# EAGLE design a8_dev (EAGLE 6.5.0)
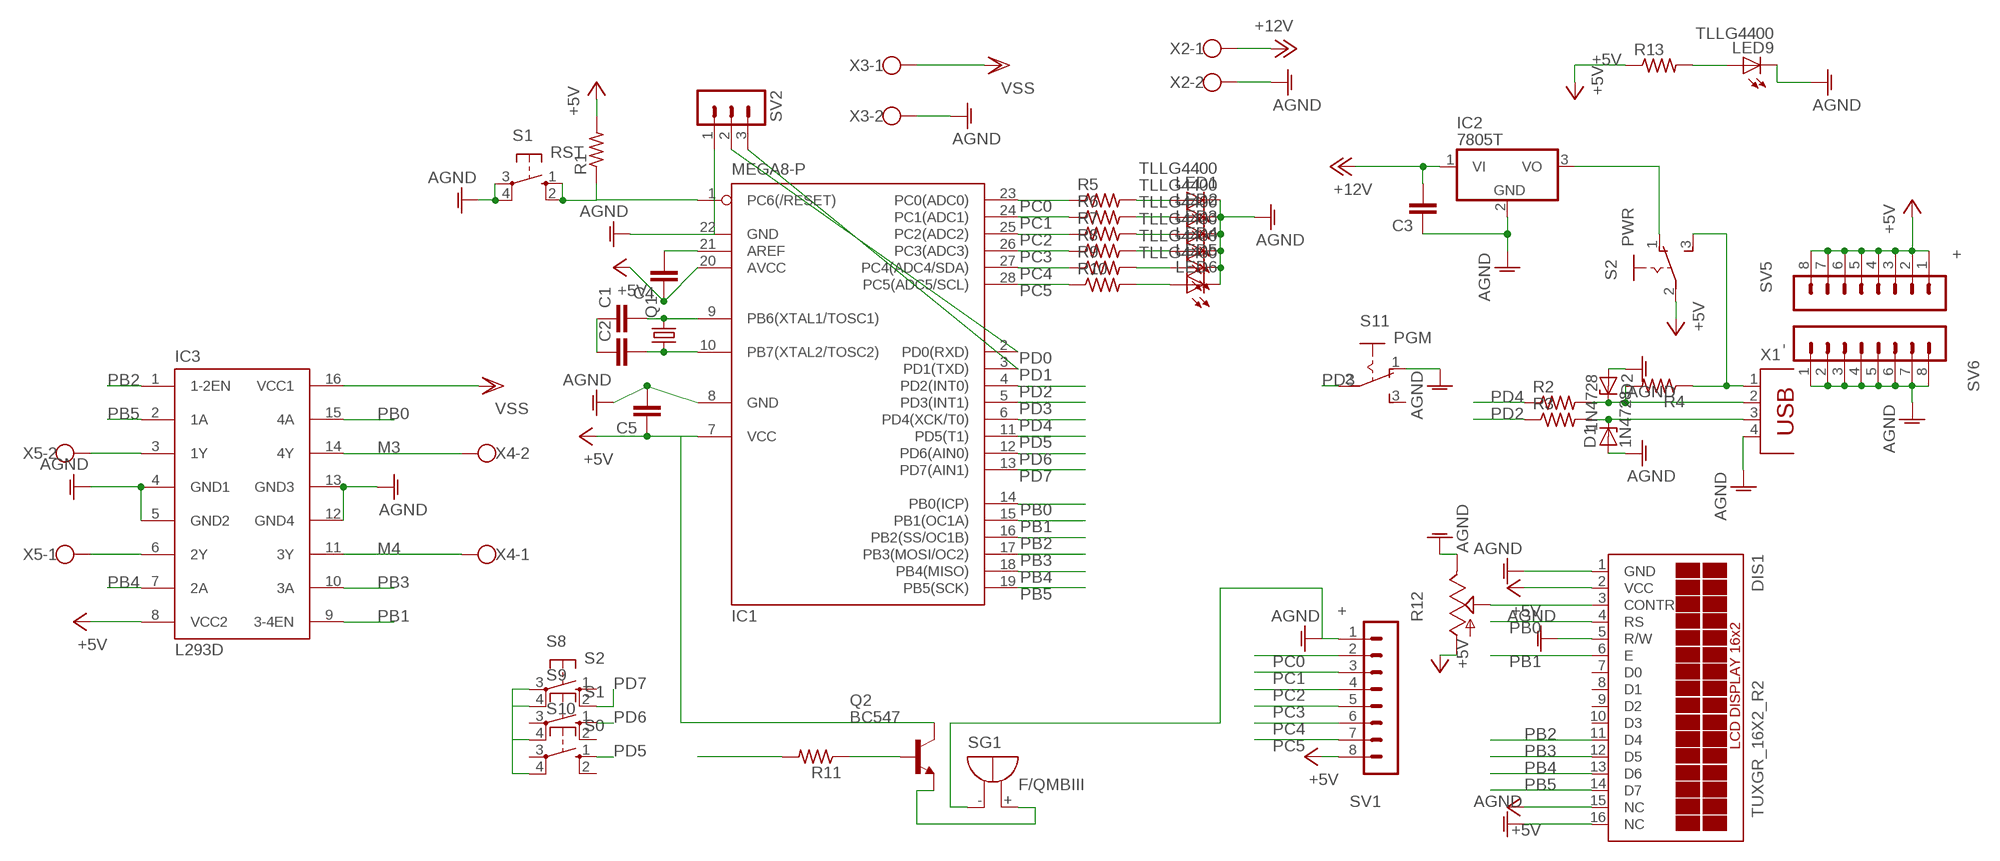
[diagram p0: schematic, sheet 1]

## Parts
C1  C2.5/6  [C2.5-6]
C2  C2.5/6  [C2.5-6]
C3  C2.5/6  [C2.5-6]
C4  C2.5/6  [C2.5-6]
C5  C2.5/6  [C2.5-6]
D1  1N4728  [DO41Z10]
D2  1N4728  [DO41Z10]
DIS1  TUXGR_16X2_R2  [TUXGR_16X2_R2]
IC1  MEGA8-P  [DIL28-3]
IC2  7805T  [TO220H]
IC3  L293D  [DIL16]
LED1  TLLG4400  [LED3MM]
LED2  TLLG4400  [LED3MM]
LED3  TLLG4400  [LED3MM]
LED4  TLLG4400  [LED3MM]
LED5  TLLG4400  [LED3MM]
LED6  TLLG4400  [LED3MM]
LED9  TLLG4400  [LED3MM]
Q1  CRYSTALHC18U-V  [HC18U-V]
Q2  BC547  [TO92]
R1  R-US_0207/7  [0207/7]
R2  R-US_0309/12  [0309/12]
R3  R-US_0309/12  [0309/12]
R4  R-US_0309/12  [0309/12]
R5  R-US_0309/12  [0309/12]
R6  R-US_0309/12  [0309/12]
R7  R-US_0309/12  [0309/12]
R8  R-US_0309/12  [0309/12]
R9  R-US_0309/12  [0309/12]
R10  R-US_0309/12  [0309/12]
R11  R-US_0207/7  [0207/7]
R12  TRIM_US-CA6V  [CA6V]
R13  R-US_0309/12  [0309/12]
S1  RST  10-XX  [B3F-10XX]
S2  PWR  255SB  [255SB]
S8  S2  10-XX  [B3F-10XX]
S9  S1  10-XX  [B3F-10XX]
S10  S0  10-XX  [B3F-10XX]
S11  PGM  255SB  [255SB]
SG1  F/QMBIII  [F/QMBIII]
SV1  +  MA08-1  [MA08-1]
SV2  MA03-1  [MA03-1]
SV5  +  MA08-1  [MA08-1]
SV6  -  MA08-1  [MA08-1]
X1  PN61729  [PN61729]
X2  W237-102  [W237-102]
X3  W237-102  [W237-102]
X4  W237-102  [W237-102]
X5  W237-102  [W237-102]

## Nets
+5V: C4.1 C5.1 DIS1.2(VCC) DIS1.15(NC) IC1.7(VCC) IC1.20(AVCC) IC3.8(VCC2) Q2.3(C) R1.2 R12.A R13.1 S2.2(P) SV1.8 SV5.1 SV5.2 SV5.3 SV5.4 SV5.5 SV5.6 SV5.7 SV5.8
+12V: C3.2 IC2.1(VI) X2.1
AGND: C1.1 C2.1 C3.1 C5.2 D1.A D2.A DIS1.1(GND) DIS1.5(R/W) DIS1.16(NC) IC1.8(GND) IC1.22(GND) IC2.2(GND) IC3.4(GND1) IC3.5(GND2) IC3.12(GND4) IC3.13(GND3) LED1.K(C) LED2.K(C) LED3.K(C) LED4.K(C) LED5.K(C) LED6.K(C) LED9.K(C) R12.E S1.3(P) S1.4(P1) S8.3(P) S8.4(P1) S9.4(P1) S10.4(P1) S11.1(O) SG1.-(+) SV1.1 SV2.1 SV6.1 SV6.2 SV6.3 SV6.4 SV6.5 SV6.6 SV6.7 SV6.8 X1.4 X2.2 X3.2
M3: IC3.14(4Y) X4.2
M4: IC3.11(3Y) X4.1
N$1: LED9.A R13.2
N$2: D2.C R2.2 R4.2 X1.2
N$3: IC3.3(1Y) X5.2
N$4: IC3.6(2Y) X5.1
N$5: C4.2 IC1.21(AREF)
N$6: DIS1.3(CONTR) R12.S
N$7: Q2.1(E) SG1.+(-)
N$9: LED1.A R5.2
N$10: IC1.1(PC6(/RESET)) R1.1 S1.1(S) S1.2(S1)
N$11: IC2.3(VO) S2.1(O)
N$12: R4.1 S2.3(S) X1.1
N$14: D1.C R3.2 X1.3
N$15: LED2.A R6.2
N$16: LED3.A R7.2
N$25: LED4.A R8.2
N$26: LED5.A R9.2
N$27: LED6.A R10.2
NSB: Q2.2(B) R11.1
PB0: DIS1.4(RS) IC1.14(PB0(ICP)) IC3.15(4A)
PB1: DIS1.6(E) IC1.15(PB1(OC1A)) IC3.9(3-4EN)
PB2: DIS1.11(D4) IC1.16(PB2(SS/OC1B)) IC3.1(1-2EN)
PB3: DIS1.12(D5) IC1.17(PB3(MOSI/OC2)) IC3.10(3A)
PB4: DIS1.13(D6) IC1.18(PB4(MISO)) IC3.7(2A)
PB5: DIS1.14(D7) IC1.19(PB5(SCK)) IC3.2(1A)
PB6: C1.2 IC1.9(PB6(XTAL1/TOSC1)) Q1.2
PB7: C2.2 IC1.10(PB7(XTAL2/TOSC2)) Q1.1
PC0: IC1.23(PC0(ADC0)) R5.1 SV1.2
PC1: IC1.24(PC1(ADC1)) R6.1 SV1.3
PC2: IC1.25(PC2(ADC2)) R7.1 SV1.4
PC3: IC1.26(PC3(ADC3)) R8.1 SV1.5
PC4: IC1.27(PC4(ADC4/SDA)) R9.1 SV1.6
PC5: IC1.28(PC5(ADC5/SCL)) R10.1 SV1.7
PD0: IC1.2(PD0(RXD)) R11.2 SV2.2
PD1: IC1.3(PD1(TXD)) SV2.3
PD2: IC1.4(PD2(INT0)) R3.1
PD3: IC1.5(PD3(INT1)) S11.2(P)
PD4: IC1.6(PD4(XCK/T0)) R2.1
PD5: IC1.11(PD5(T1)) S10.1(S)
PD6: IC1.12(PD6(AIN0)) S9.1(S)
PD7: IC1.13(PD7(AIN1)) S8.2(S1)
VSS: IC3.16(VCC1) X3.1
Unconnected: DIS1.7(D0) DIS1.8(D1) DIS1.9(D2) DIS1.10(D3) S8.1(S) S9.2(S1) S9.3(P) S10.2(S1) S10.3(P) S11.3(S)

## Library data of the parts
C1-C5 = capacitor-wima:C: CAPACITOR naming: grid - package width
D1 D2 = diode:1N4728: Z DIODE 3.3 V, 1W, 5 percent
DIS1 = display-lcd:TUXGR_16X2_R2: Tuxgraphics LCD display 16x2 characters reflective, without background light Source: tuxgr_12x2_r2.pdf; OC_FARNELL: unknown; OC_NEWARK: unknown
IC1 = atmel:MEGA8-P: MICROCONTROLLER 8 Kbytes FLASH, 1 kbytes SRAM, 512 bytes EEPROM, USART, 4-channel 10 bit ADC, 2-channel 8 bit ADC Pin compatible with Atmega48, ATMega88, ATMega168 Source: avr.lbr; OC_FARNELL: unknown; OC_NEWARK: unknown
IC2 = linear:78*: Positive VOLTAGE REGULATOR Source: http://cache.national.com/ds/LM/LM78L05.pdf http://www.fairchildsemi.com/ds/LM/LM7805.pdf
IC3 = st-microelectronics:L293D: PUSH-PULL 4 CHANNEL DRIVER; MPN: L293D; OC_FARNELL: 9589619; OC_NEWARK: 56P8249
LED1-LED6 LED9 = led:TLLG4400: Low Current (2mA) LED 3 mm Tinted Diffused Package color GREEN Source: Data sheet <http://www.farnell.com/datasheets/391098.pdf>; MF: VISHAY SEMICONDUCTOR; OC_FARNELL: 1612435
Q1 = crystal:CRYSTAL: CRYSTAL; OC_FARNELL: unknown; OC_NEWARK: unknown
Q2 = transistor-npn:BC547*: NPN Transistor
R1-R11 R13 = resistor:R-US_: RESISTOR, American symbol
R12 = pot:TRIM_US-: POTENTIOMETER
S1 S8-S10 = switch-omron:10-XX: OMRON SWITCH; MPN: B3F-1000; OC_FARNELL: 176432; OC_NEWARK: 36M3542
S2 S11 = switch:255SB: SLIDING SWITCH Distributor Buerklin, 11G810
SG1 = buzzer:F/QMBIII: BUZZER Source: Buerklin; OC_FARNELL: unknown; OC_NEWARK: unknown
SV1 SV5 SV6 = con-lstb:MA08-1: PIN HEADER; OC_FARNELL: unknown; OC_NEWARK: unknown
SV2 = con-lstb:MA03-1: PIN HEADER; OC_FARNELL: unknown; OC_NEWARK: unknown
X1 = con-berg:PN61729: BERG USB connector; OC_FARNELL: unknown; OC_NEWARK: unknown
X2-X5 = con-wago-500:W237-102: WAGO SCREW CLAMP; MPN: 237-102; OC_FARNELL: unknown; OC_NEWARK: 70K9898

## Board
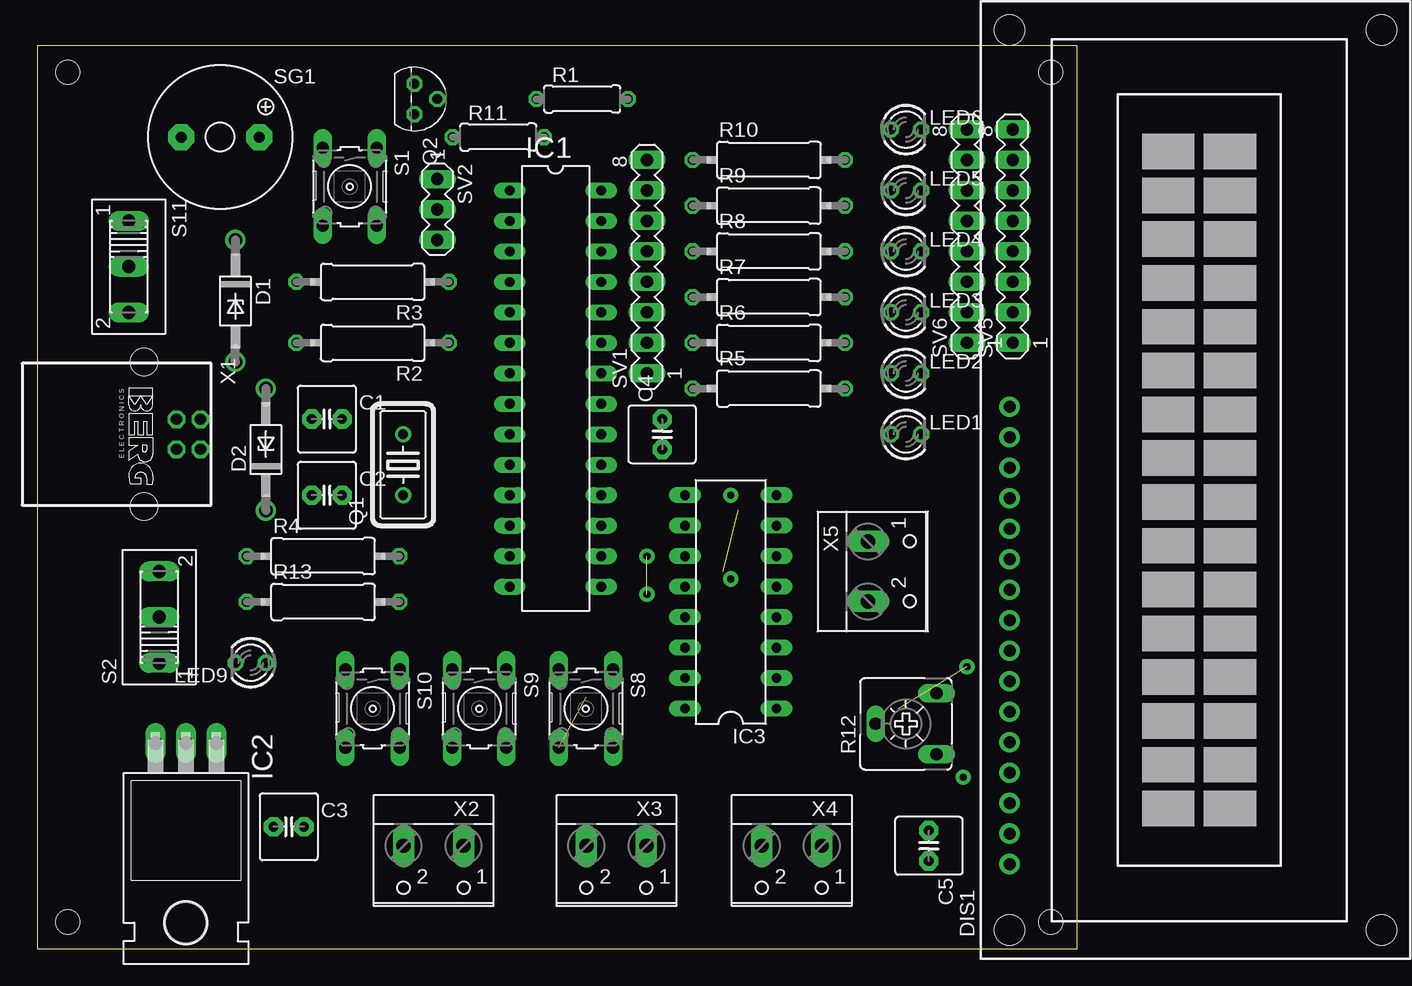
[diagram p1: board, top side]
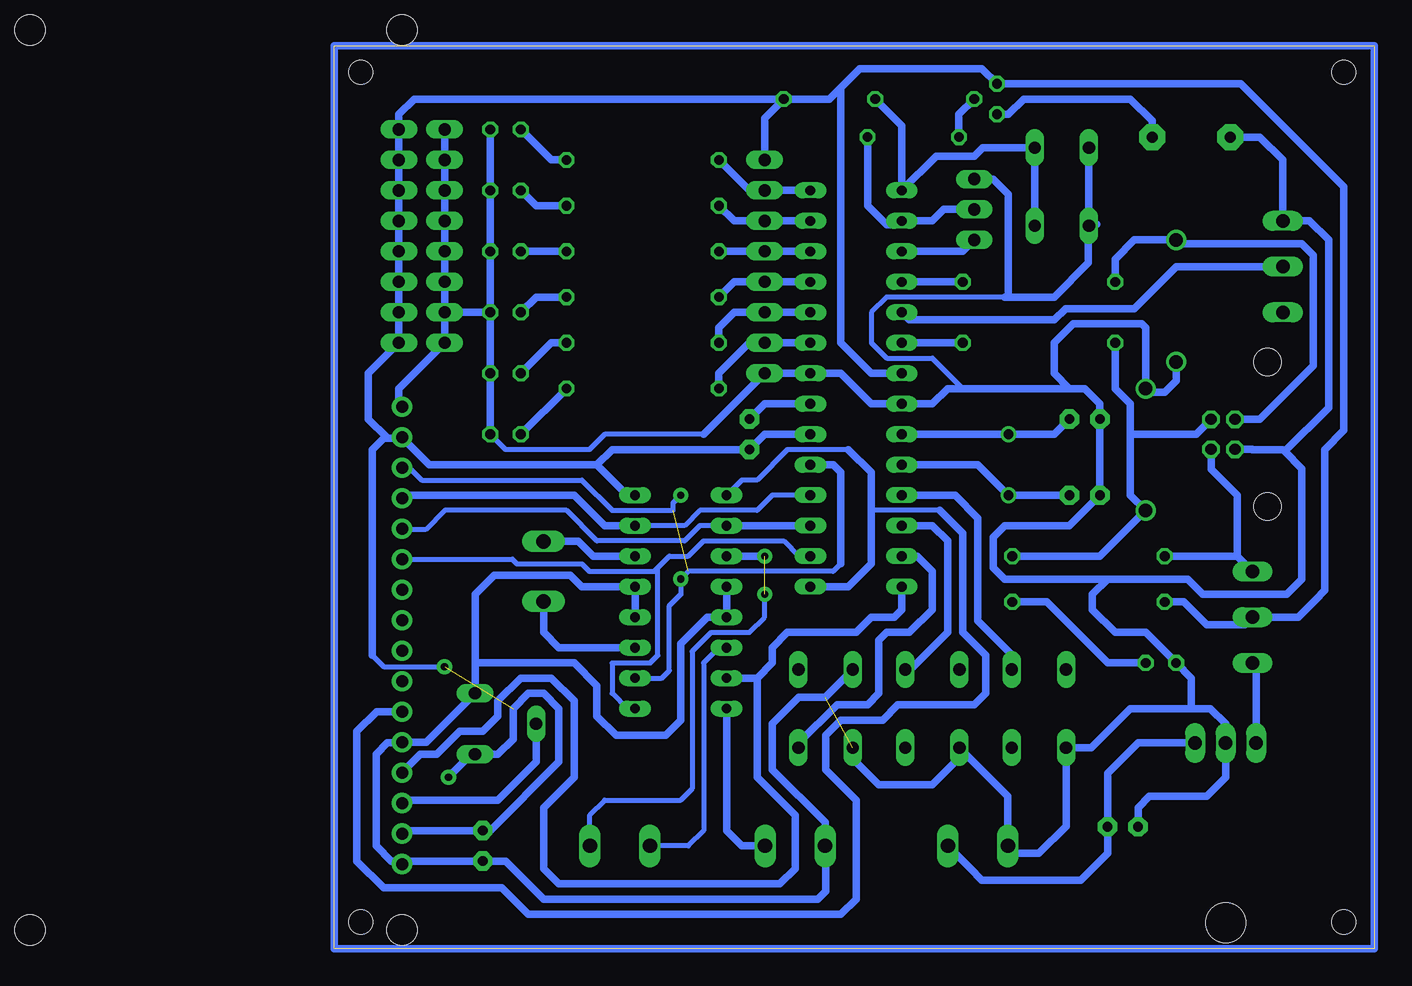
[diagram p2: board, bottom side, seen from below]

Size 86.66 x 75.23 mm. Coordinates in mm from the lower left corner, seen from the top.
Outline: 0,0 86.66,0 86.66,75.23 0,75.23 0,0
Copper layers (1*16): Top 0.035mm / dielectric 1.5mm / Bottom 0.035mm
Design rules "default *": minimum track width 16mil, minimum drill 24mil, track to track 8mil, track to pad 8mil, pad to pad 8mil, via to via 8mil, smd to smd 8mil, copper to edge 40mil, drill to drill 8mil, minimum pad ring 10mil, minimum via ring 8mil, stop-mask expansion 4mil, vias tented up to drill 0mil, thermal gap 10mil
Holes 2 mm at 2.54,73.03 84.46,73.03 84.46,2.22 2.54,2.22

### Footprints (pad centres in the part's own frame; a part is rotated, then mirrored left to right if it is on the bottom)
C2.5-6 = drill 0.813 pad 1.6 octagon: 1 -1.27,0; 2 1.27,0
DO41Z10 = drill 1.118: A 5.08,0; C -5.08,0
TUXGR_16X2_R2 = drill 1 pad 1.676: 1 -32,15.5; 2 -29.46,15.5; 3 -26.92,15.5; 4 -24.38,15.5; 5 -21.84,15.5; 6 -19.3,15.5; 7 -16.76,15.5; 8 -14.22,15.5; 9 -11.68,15.5; 10 -9.14,15.5; 11 -6.6,15.5; 12 -4.06,15.5; 13 -1.52,15.5; 14 1.02,15.5; 15 3.56,15.5; 16 6.1,15.5 | hole 2.5: -37.5,-15.5; 37.5,-15.5; -37.5,15.5; 37.5,15.5
DIL28-3 = drill 0.813 long: 1 -16.51,-3.81; 2 -13.97,-3.81; 3 -11.43,-3.81; 4 -8.89,-3.81; 5 -6.35,-3.81; 6 -3.81,-3.81; 7 -1.27,-3.81; 8 1.27,-3.81; 9 3.81,-3.81; 10 6.35,-3.81; 11 8.89,-3.81; 12 11.43,-3.81; 13 13.97,-3.81; 14 16.51,-3.81; 15 16.51,3.81; 16 13.97,3.81; 17 11.43,3.81; 18 8.89,3.81; 19 6.35,3.81; 20 3.81,3.81; 21 1.27,3.81; 22 -1.27,3.81; 23 -3.81,3.81; 24 -6.35,3.81; 25 -8.89,3.81; 26 -11.43,3.81; 27 -13.97,3.81; 28 -16.51,3.81
TO220H = drill 1.118 long: 1 -2.54,-10.16; 2 0,-10.16; 3 2.54,-10.16 | hole 3.302: 0,4.826
DIL16 = drill 0.813 long: 1 -8.89,-3.81; 2 -6.35,-3.81; 3 -3.81,-3.81; 4 -1.27,-3.81; 5 1.27,-3.81; 6 3.81,-3.81; 7 6.35,-3.81; 8 8.89,-3.81; 9 8.89,3.81; 10 6.35,3.81; 11 3.81,3.81; 12 1.27,3.81; 13 -1.27,3.81; 14 -3.81,3.81; 15 -6.35,3.81; 16 -8.89,3.81
LED3MM = drill 0.813 octagon: A -1.27,0; K 1.27,0
HC18U-V = drill 0.813: 1 -2.54,0; 2 2.54,0
TO92 = drill 0.813 octagon: 1 1.27,0; 2 0,1.905; 3 -1.27,0
0207/7 = drill 0.813 octagon: 1 -3.81,0; 2 3.81,0
0309/12 = drill 0.813 octagon: 1 -6.35,0; 2 6.35,0
CA6V = drill 1.016 long: A -2.54,-2.54; E 2.54,-2.54; S 0,2.54
B3F-10XX = drill 1.016 long: 1 -3.251,2.261; 2 3.251,2.261; 3 -3.251,-2.261; 4 3.251,-2.261
255SB = drill 1.118 long: 1 -3.81,0; 2 0,0; 3 3.81,0
F/QMBIII = drill 0.914 pad 2.159 octagon: + 3.251,0; - -3.251,0
MA08-1 = drill 1.016 long: 1 -8.89,0; 2 -6.35,0; 3 -3.81,0; 4 -1.27,0; 5 1.27,0; 6 3.81,0; 7 6.35,0; 8 8.89,0
MA03-1 = drill 1.016 long: 1 -2.54,0; 2 0,0; 3 2.54,0
PN61729 = drill 0.95 octagon: 1 1.25,4.71; 2 -1.25,4.71; 3 -1.25,2.71; 4 1.25,2.71 | hole 2.3: -6.02,0; 6.02,0
W237-102 = drill 1.194 long: 1 -2.5,-1.27; 2 2.5,-1.27

### Placement (x,y rotation side)
C1  24.13,44.13 0 top
C2  24.13,37.78 0 top
C3  20.96,10.16 0 top
C4  52.07,42.86 90 top
C5  74.3,8.57 270 top
D1  16.51,53.98 270 top
D2  19.05,41.59 90 top
DIS1  96.52,39.05 90 top
IC1  43.18,46.67 270 top
IC2  12.38,6.99 180 top
IC3  57.79,28.89 90 top
LED1  72.39,42.86 0 top
LED2  72.39,47.94 0 top
LED3  72.39,53.02 0 top
LED4  72.39,58.1 0 top
LED5  72.39,63.18 0 top
LED6  72.39,68.26 0 top
LED9  17.78,23.81 180 top
Q1  30.48,40.32 90 top
Q2  31.43,70.8 270 top
R1  45.4,70.8 0 top
R2  27.94,50.48 180 top
R3  27.94,55.56 180 top
R4  23.81,32.7 0 top
R5  60.96,46.67 0 top
R6  60.96,50.48 0 top
R7  60.96,54.29 0 top
R8  60.96,58.1 0 top
R9  60.96,61.91 0 top
R10  60.96,65.72 0 top
R11  38.42,67.63 0 top
R12  72.39,18.73 90 top
R13  23.81,28.89 0 top
S1  26.04,63.5 270 top
S2  10.16,27.62 90 top
S8  45.72,20 270 top
S9  36.83,20 270 top
S10  27.94,20 270 top
S11  7.62,56.83 270 top
SG1  15.24,67.63 0 top
SV1  50.8,56.83 90 top
SV2  33.34,61.6 270 top
SV5  81.28,59.37 90 top
SV6  77.47,59.37 90 top
X1  8.89,42.86 270 top
X2  33.02,7.3 180 top
X3  48.26,7.3 180 top
X4  62.87,7.3 180 top
X5  70.49,31.43 270 top

### Tracks (layer width: path | path; a pad name or v marks a point on that pad's centre or on a via)
+5V  (via drill 0.6 pad 1.27)  (1 unrouted)
  Bottom 0.406: 82.3,42.61 DIS1.15 81.28,42.86 80.96,42.55 | 83.5,24.45 82.55,23.49 v77.47,23.49 | R12.A 75.25,16.19
  Bottom 0.61: IC1.20 50.8,42.86 C4.1 63.5,41.59 64.77,40.32 | 82.3,42.61 83.82,44.13 83.82,47.94 SV5.1 SV5.2 SV5.3 SV5.4 SV5.5 SV5.6 SV5.7 SV5.8 81.28,69.53 80.01,70.8 R1.2 | IC1.7 41.91,47.94 44.45,50.48 44.45,71.76 | DIS1.2 81.28,9.84 C5.1 73.66,9.84 67.94,15.56 67.94,20 69.22,21.27 70.49,21.27 71.75,20 71.75,17.46 73.03,16.19 R12.A | R13.1 15.88,28.89 13.97,26.99 10.8,26.99 S2.2 6.35,27.62 4.92,29.05 4.13,29.84 4.13,41.59 2.54,43.18 2.54,63.5 11.11,72.07 Q2.3 32.7,73.34 42.86,73.34 44.45,71.76 | IC3.8 62.23,37.78 64.77,40.32 | 64.77,40.32 78.74,40.32 80.96,42.55 82.55,42.55 83.5,41.59 83.5,24.45 | 75.25,16.19 v77.15,14.29 | SV1.8 50.8,69.21 R1.2 | R1.2 45.4,70.8 44.45,71.76
+12V
  Bottom 0.406: 35.56,8.57 X2.1
  Bottom 0.61: 35.56,8.57 33.34,6.35 33.02,6.03 32.7,5.72 24.45,5.72 22.23,7.94 C3.2 22.23,14.61 19.69,17.15 IC2.1
AGND  (1 unrouted)
  Bottom 0.406: 25.4,16.19 S10.4 | 30.48,8.57 X2.2 | 80.77,7.3 DIS1.1 | S9.4 34.57,15.91 | 43.82,16.19 43.82,16.4 | 45.72,8.57 X3.2 | 55.88,42.86 64.13,42.86 65.41,41.59 72.39,41.59 LED1.K | 23.81,60.21 S1.4 | 34.29,46.67 36.83,49.21 40.64,49.21 41.91,50.48 41.91,53.02 40.64,54.29 30.8,54.29 30.48,54.61 | 7.46,41.43 7.62,41.59 | 10.16,41.59 10.18,41.61
  Bottom 0.61: SV6.8 SV6.7 SV6.6 SV6.5 SV6.4 SV6.3 SV6.2 | SV6.2 SV6.1 81.28,46.67 81.28,45.41 DIS1.16 | C2.1 C1.1 22.86,45.4 24.13,46.67 25.4,46.67 | 25.4,46.67 34.29,46.67 35.56,46.67 36.83,45.4 IC1.8 41.91,45.4 44.45,47.94 IC1.22 SV1.1 55.88,42.86 | LED6.K LED5.K LED4.K LED3.K | LED1.K LED2.K LED3.K | 23.14,60.36 S1.4 S1.3 | 30.8,54.29 26.67,54.29 23.81,57.15 23.81,60.21 | 25.4,46.67 26.67,47.94 26.67,50.48 25.08,52.07 19.37,52.07 19.05,51.75 D2.A 18.73,46.35 17.46,46.35 16.51,47.31 D1.A | 15.24,20 15.24,22.54 LED9.K 19.05,26.35 21.59,26.35 23.5,28.26 23.5,29.53 22.23,30.8 | 10.18,41.61 X1.4 | LED3.K SV6.2 | 25.4,17.46 S10.4 | 22.23,30.8 15.56,30.8 14.29,29.53 7.3,29.53 6.03,30.8 6.03,40.01 7.46,41.43 3.81,45.09 3.81,59.06 5.4,60.64 S11.1 7.62,65.72 9.53,67.63 SG1.- | DIS1.5 78.99,17.21 R12.E 74.93,23.81 | 81.27,17.46 DIS1.5 | IC3.12 IC3.13 55.56,27.62 57.79,25.4 57.79,19.05 59.05,17.78 63.18,17.78 64.77,19.37 64.77,21.91 66.68,23.81 74.93,23.81 | IC3.4 IC3.5 66.04,30.16 66.99,31.12 73.34,31.12 74.93,29.53 74.93,23.81 | S10.4 23.57,16.75 20.32,20 15.24,20 | S10.4 25.68,10.2 27.94,7.94 29.88,7.94 X2.2 30.52,12.7 S9.4 | 34.57,15.91 36.83,13.65 41.27,13.65 43.82,16.19 | 43.82,16.4 S8.4 | 45.72,8.57 45.72,4.76 46.35,4.13 69.22,4.13 72.39,7.3 C5.2 80.77,7.3 81.91,7.3 83.19,8.57 83.19,16.19 82.23,17.15 81.09,17.15 DIS1.5 | X3.2 45.76,10.52 50.16,14.92 50.16,18.73 47.94,20.95 45.76,20.95 S8.3 | 15.24,20 13.65,20 12.38,18.73 IC2.2 12.38,14.29 13.97,12.7 18.73,12.7 19.69,11.75 C3.1 | C2.1 22.86,37.46 | 22.23,30.8 30.8,30.8 31.75,31.75 31.75,34.29 30.8,35.24 25.4,35.24 C2.1 | 7.62,41.59 10.16,41.59
  Bottom 0.61: SV2.1 31.75,64.13 30.48,62.87 30.48,54.61
M3
  Bottom 0.406: IC3.14 54.61,25.08 55.88,23.81 55.88,9.84 57.15,8.57 X4.2
M4  (via drill 0.6 pad 1.27)  (1 unrouted)
  Bottom 0.406: X4.1 65.37,11.15 64.13,12.38 57.79,12.38 56.83,13.34 56.83,24.77 55.24,26.35 52.07,26.35 50.8,27.62 50.8,29.53
  Bottom 0.61: IC3.11 v50.8,32.7
N$1
  Bottom 0.61: R13.2 27.3,28.89 22.23,23.81 LED9.A
N$2
  Bottom 0.61: 20.32,42.86 20.32,37.78 D2.C 22.86,32.7 R4.2 | 20.32,42.86 20.32,45.4 21.59,46.67 R2.2 | X1.2 14.85,42.86 20.32,42.86
N$3
  Bottom 0.61: IC3.3 67.94,25.08 69.22,26.35 X5.2
N$4
  Bottom 0.61: X5.1 66.32,33.93 65.09,32.7 IC3.6
N$5
  Bottom 0.61: IC1.21 50.8,45.4 C4.2
N$6
  Bottom 0.61: R12.S 69.85,15.56 73.03,12.38 80.77,12.38 DIS1.3
N$7
  Bottom 0.61: Q2.1 30.48,69.53 29.21,70.8 20.32,70.8 18.49,68.97 SG1.+
N$9
  Bottom 0.61: R5.2 LED1.A
N$10
  Bottom 0.61: S1.2 S1.1 32.63,66.75 33.34,66.04 36.51,66.04 IC1.1 39.37,68.58 R1.1
N$11
  Bottom 0.61: IC2.3 9.84,23.49 S2.1
N$12
  Bottom 0.61: X1.1 13.6,39.95 11.43,37.78 11.43,32.7 | R4.1 11.43,32.7 | 11.43,32.7 S2.3
N$14
  Bottom 0.61: R3.2 21.59,57.47 20,59.06 D1.C 16.19,58.74 6.03,58.74 5.08,57.78 5.08,51.12 5.08,50.48 5.08,48.58 9.55,44.11 X1.3
N$15
  Bottom 0.61: R6.2 68.58,50.48 LED2.A
N$16
  Bottom 0.61: R7.2 69.85,54.29 LED3.A
N$17  (via drill 0.6 pad 1.27)
  other vias: 50.8,29.53
N$19  (via drill 1.2 pad 1.93)
  other vias: 2.54,73.03
N$20  (via drill 1.2 pad 1.93)
  other vias: 84.46,73.03
N$21  (via drill 1.2 pad 1.93)
  other vias: 84.46,2.22
N$22  (via drill 1.2 pad 1.93)
  other vias: 2.54,2.22
N$23
  Bottom 0.61: 0,75.25 86.68,75.25 86.68,0 0,0 0,75.25
N$25
  Bottom 0.61: R8.2 LED4.A
N$26
  Bottom 0.61: R9.2 69.85,61.91 LED5.A
N$27
  Bottom 0.61: R10.2 68.58,65.72 LED6.A
NSB
  Bottom 0.61: R11.1 34.61,69.53 Q2.2
PB0
  Bottom 0.61: DIS1.4 79.5,16.19 78.1,16.19 76.2,18.1 74.3,18.1 73.03,19.37 73.03,20.64 71.12,22.54 68.58,22.54 66.68,20.64 66.68,14.29 69.22,11.75 69.22,6.67 67.94,5.4 49.53,5.4 48.26,6.67 48.26,11.11 51.44,14.29 51.44,22.54 | IC1.14 39.37,28.26 40.01,27.62 41.91,27.62 43.18,26.35 48.9,26.35 50.16,25.08 50.16,23.81 51.44,22.54 | 51.44,22.54 IC3.15
PB1
  Bottom 0.406: 43.82,41.59 48.9,41.59 51.44,39.05 52.71,39.05 IC3.9 | 36.2,36.51 41.91,36.51
  Bottom 0.61: IC1.15 43.82,30.16 41.91,32.07 41.91,36.51 41.91,39.69 43.82,41.59 | DIS1.6 83.12,19.75 84.77,18.1 84.77,7.3 82.55,5.08 72.71,5.08 70.49,2.86 44.45,2.86 43.18,4.13 43.18,12.38 45.72,14.92 45.72,17.78 44.45,19.05 40.96,19.05 39.69,20.32 33.34,20.32 32.38,21.27 32.38,24.45 34.29,26.35 34.29,34.61 36.2,36.51
PB2
  Bottom 0.406: IC3.1 62.23,20 63.5,21.27 63.5,23.81 60.32,23.81 59.69,24.45 59.69,31.75 | DIS1.11 71.82,32.45 71.44,32.07 66.04,32.07 65.41,31.43 60.01,31.43 59.69,31.75 | 59.69,31.75 58.74,32.7 57.15,32.7 55.88,33.97 49.21,33.97 47.94,32.7 IC1.16
PB3
  Bottom 0.406: IC3.10 56.2,35.24 57.47,33.97 64.77,33.97 67.31,36.51 77.47,36.51 79.06,34.92 80.95,34.92 DIS1.12
  Bottom 0.61: IC3.10 IC1.17
PB4
  Bottom 0.406: 60.96,35.24 IC3.7 57.47,35.24 56.2,36.51 51.44,36.51 50.16,37.78 IC1.18
  Bottom 0.61: IC3.7 64.13,35.24 66.68,37.78 80.77,37.78 DIS1.13
PB5  (via drill 0.6 pad 1.27)  (1 unrouted)
  Bottom 0.406: DIS1.14 80.4,40.07 79.38,39.05 66.04,39.05 63.5,36.51 58.42,36.51 58.42,37.15 v57.79,37.78 | 44.45,32.07 45.09,31.43 57.15,31.43 v57.79,30.8 57.79,29.53 58.74,28.57 58.74,23.18 59.37,22.54 IC3.2
  Bottom 0.61: IC1.19 45.09,40.32 44.45,39.69 44.45,32.07
PB6
  Bottom 0.61: IC1.9 Q1.2 26.67,42.86 C1.2
PB7
  Bottom 0.61: IC1.10 33.02,40.32 Q1.1 C2.2
PC0
  Bottom 0.61: IC1.23 SV1.2 52.07,50.48 54.61,47.94 R5.1
PC1
  Bottom 0.61: IC1.24 SV1.3 53.34,53.02 54.61,51.75 R6.1
PC2
  Bottom 0.61: IC1.25 SV1.4 53.34,55.56 R7.1
PC3
  Bottom 0.61: IC1.26 SV1.5 R8.1
PC4
  Bottom 0.61: IC1.27 SV1.6 53.34,60.64 R9.1
PC5
  Bottom 0.61: IC1.28 SV1.7 52.07,63.18 R10.1
PD0
  Bottom 0.61: R11.2 42.23,61.91 40.64,60.32 39.69,60.32 IC1.2 36.83,60.64 35.88,61.6 SV2.2
PD1
  Bottom 0.61: IC1.3 34.29,58.1 SV2.3
PD2
  Bottom 0.61: IC1.4 R3.1
PD3
  Bottom 0.61: S11.2 16.51,56.83 20,53.34 25.72,53.34 26.67,52.39 38.74,52.39 IC1.5
PD4
  Bottom 0.61: IC1.6 R2.1
PD5
  Bottom 0.406: 30.16,23.29 S10.1
  Bottom 0.61: IC1.11 34.93,37.78 33.02,35.88 33.02,27.31 30.16,24.45 30.16,23.29
PD6
  Bottom 0.61: S9.1 38.66,23.25 35.56,26.35 35.56,33.97 36.83,35.24 IC1.12
PD7
  Bottom 0.61: IC1.13 38.1,32.7 36.83,31.43 36.83,28.26 38.74,26.35 40.64,26.35 41.27,25.72 41.27,21.27 42.23,20.32 44.77,20.32 47.98,17.11 S8.2
VSS
  Bottom 0.61: X3.1 52.71,8.57 53.98,9.84 IC3.16